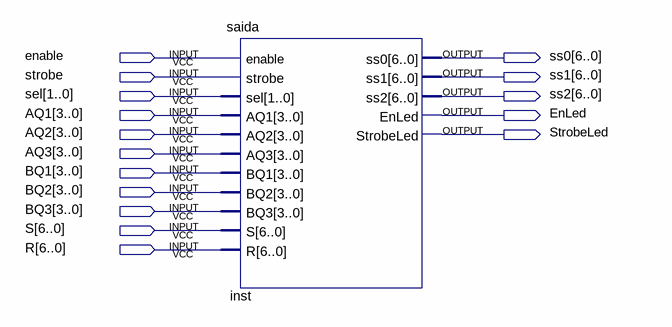
[diagram p0: schematic sheet]
// Quartus schematic testSaida.bdf as structural Verilog: 1 symbols, 16 pins
module testSaida (
  input  enable,
  input  strobe,
  input  [1:0] sel,
  input  [3:0] AQ1,
  input  [3:0] AQ2,
  input  [3:0] AQ3,
  input  [3:0] BQ1,
  input  [3:0] BQ2,
  input  [3:0] BQ3,
  input  [6:0] S,
  input  [6:0] R,
  output [6:0] ss0,
  output [6:0] ss1,
  output [6:0] ss2,
  output EnLed,
  output StrobeLed
);

  saida inst (
    .enable(enable), .strobe(strobe), .sel(sel), .AQ1(AQ1), .AQ2(AQ2), .AQ3(AQ3), .BQ1(BQ1), .BQ2(BQ2),
    .BQ3(BQ3), .S(S), .R(R), .ss0(ss0), .ss1(ss1), .ss2(ss2), .EnLed(EnLed), .StrobeLed(StrobeLed));
endmodule
